# Altium schematic sheet 06-GPS.SchDoc
size A4
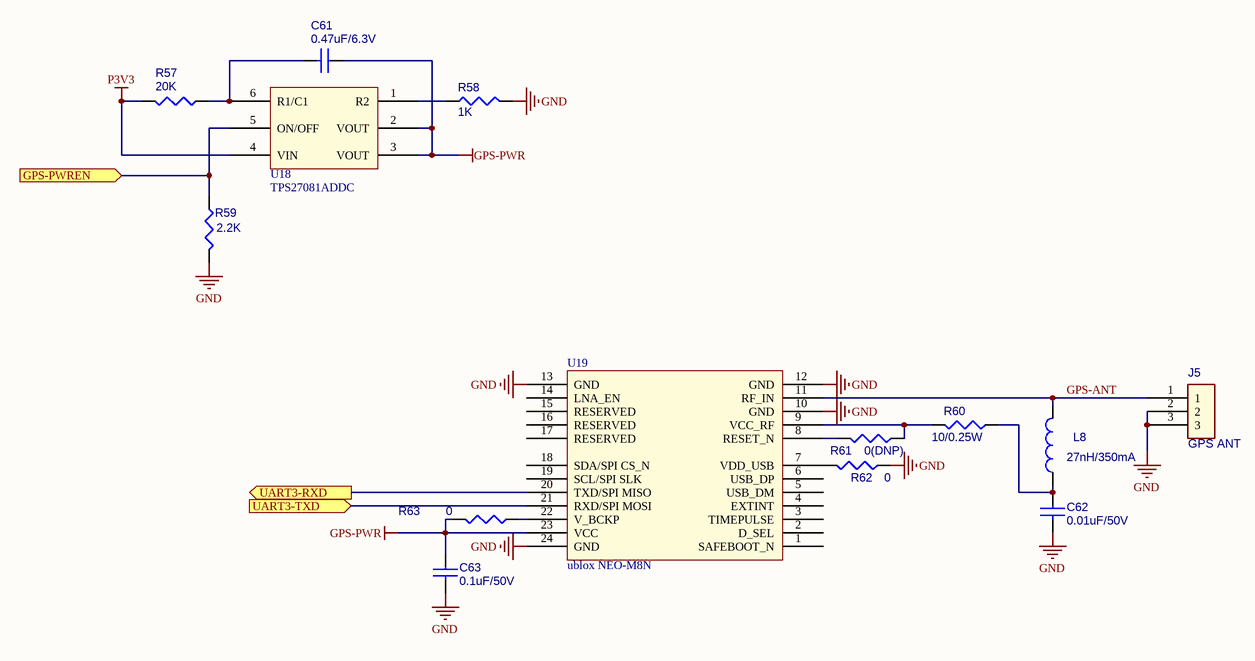
[diagram p0: 06-GPS.SchDoc]

## Parts
C61  0.47uF/6.3V  [0402]
C62  0.01uF/50V  [0402]
C63  0.1uF/50V  [0402]
J5  GPS ANT  [ANT]
L8  27nH/350mA  [0402]
R57  20K  [0402]
R58  1K  [0402]
R59  2.2K  [0402]
R60  10/0.25W  [1206]
R61  0(DNP)  [0402]
R62  0  [0402]
R63  0  [0402]
U18  TPS27081ADDC  [SOT23-6]
U19  ublox NEO-M8N  [NEO-6]

## Ports
GPS-PWREN (in), UART3-RXD (out), UART3-TXD (in)

## Nets
GND: C62.2 C63.2 J5.2 J5.3 R58.1 R59.1 R62.1 U19.10(GND) U19.12(GND) U19.13(GND) U19.24(GND)
GPS-PWR: C61.1 C63.1 R63.2 U18.2(VOUT) U18.3(VOUT) U19.23(VCC)
P3V3: R57.1 U18.4(VIN)
GPS-ANT: J5.1 L8.2 U19.11(RF_IN)
GPS-PWREN: R59.2 U18.5(ON/OFF) ; port GPS-PWREN
UART3-RXD: U19.20(TXD/SPI_MISO) ; port UART3-RXD
UART3-TXD: U19.21(RXD/SPI_MOSI) ; port UART3-TXD
NetC61_2: C61.2 R57.2 U18.6(R1/C1)
NetC62_1: C62.1 L8.1 R60.1
NetR58_2: R58.2 U18.1(R2)
NetR60_2: R60.2 R61.1 U19.9(VCC_RF)
NetR61_2: R61.2 U19.8(RESET_N)
NetR62_2: R62.2 U19.7(VDD_USB)
NetR63_1: R63.1 U19.22(V_BCKP)

Not connected (* = marked no-connect by the designer): U19 1(SAFEBOOT_N) 2(D_SEL) 3(TIMEPULSE) 4(EXTINT) 5(USB_DM) 6(USB_DP) 14(LNA_EN) 15(RESERVED) 16(RESERVED) 17(RESERVED) 18(SDA/SPI_CS_N) 19(SCL/SPI_SLK)

## Library data of the parts
C61-C63 = P_CAP NP
J5 = HRS_U_0.FL-R-SMT-10
L8 = 2.2UH_LPS3015-222MLC_1.5A_20%~D
R57-R63 = P_R
U18 = TPS27081A
U19 = NEO-M8